# Altium schematic sheet INTERFACE.SchDoc
size Letter; SheetNumber: 3; SheetTotal: 4
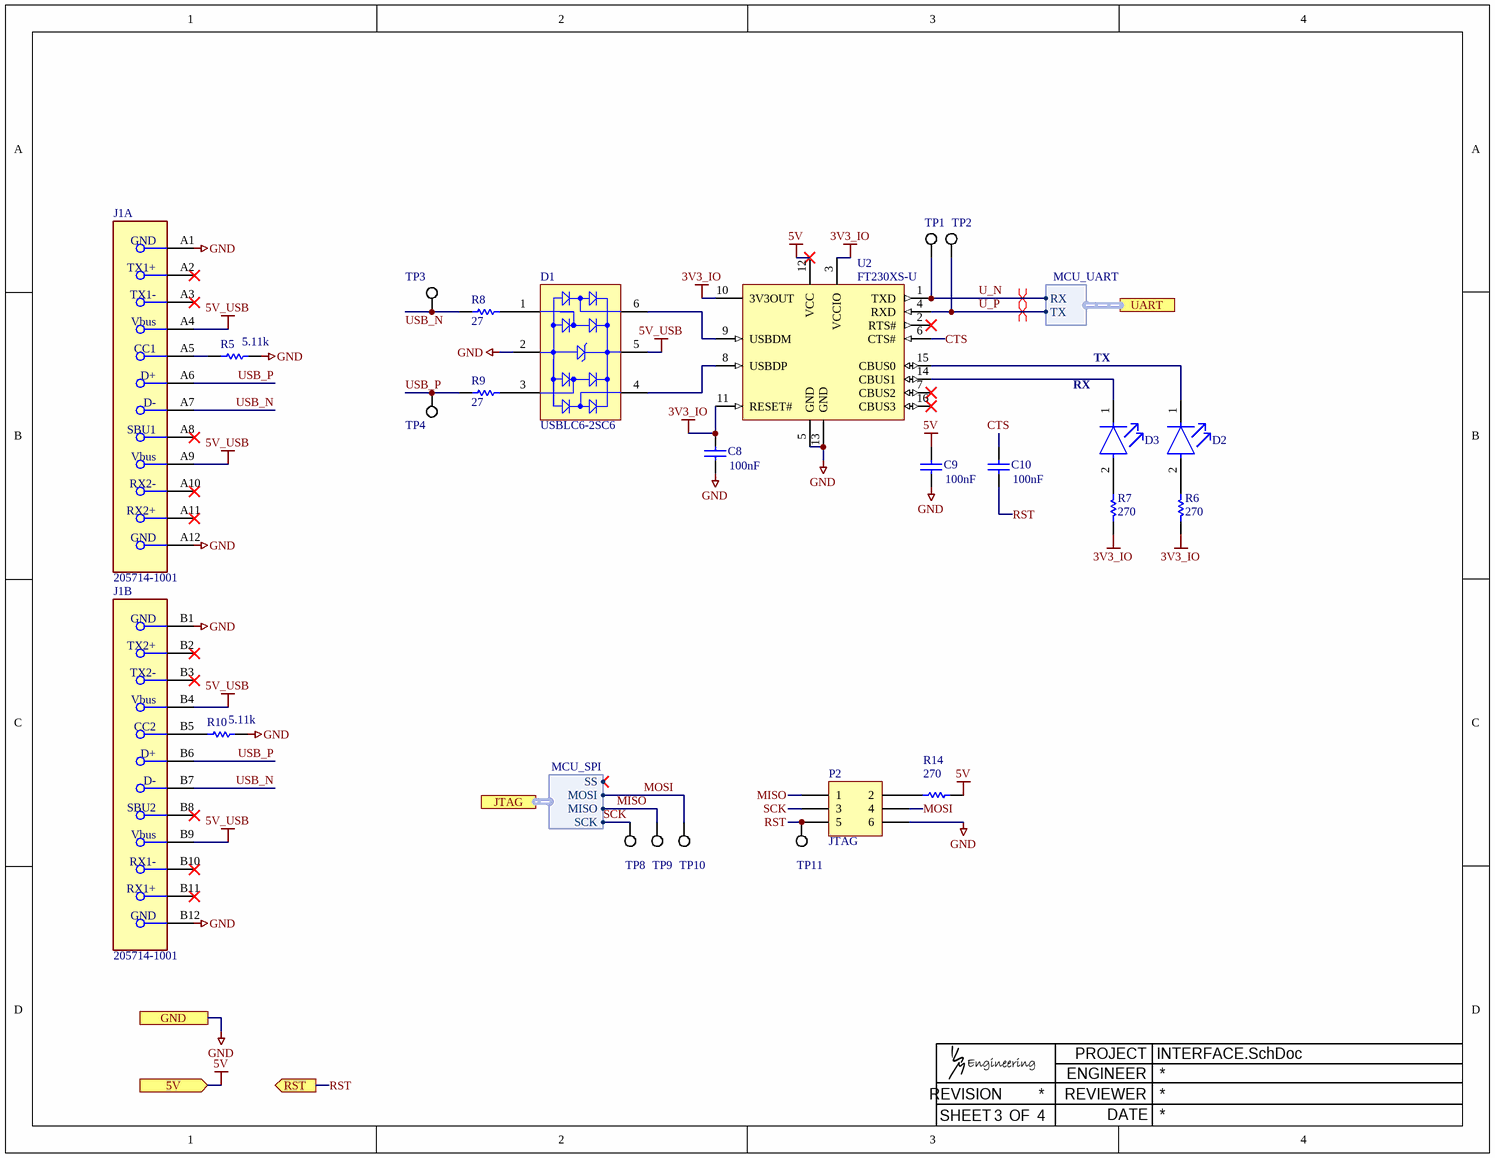
[diagram p0: INTERFACE.SchDoc]

## Parts
C8  100nF  [CAPC1005X56X25ML10T15]
C9  100nF  [CAPC1005X56X25ML10T15]
C10  100nF  [CAPC1005X56X25ML10T15]
D1  USBLC6-2SC6  [STM-SOT23-6L_V]
D2  LTST-C190KGKT  [FP-LTST-C190KGKT-MFG]  (value not drawn)
D3  LTST-C190KGKT  [FP-LTST-C190KGKT-MFG]  (value not drawn)
J1  205714-1001  [FP-205714-1001-MFG]  (parts A,B of 3)
P2  MHDR2X3  [MHDR2X3]  (value not drawn)
R5  5.11k  [RESC1005X40X25NL05T05]
R6  270  [RESC1005X40X25NL05T05]
R7  270  [RESC1005X40X25NL05T05]
R8  27  [RESC1005X40X25LL10T10]
R9  27  [RESC1005X40X25LL10T10]
R10  5.11k  [RESC1005X40X25NL05T05]
R14  270  [RESC1005X40X25NL05T05]
TP1  5019  [KSTN-5019_V]  (value not drawn)
TP2  5019  [KSTN-5019_V]  (value not drawn)
TP3  5019  [KSTN-5019_V]  (value not drawn)
TP4  5019  [KSTN-5019_V]  (value not drawn)
TP8  5019  [KSTN-5019_V]  (value not drawn)
TP9  5019  [KSTN-5019_V]  (value not drawn)
TP10  5019  [KSTN-5019_V]  (value not drawn)
TP11  5019  [KSTN-5019_V]  (value not drawn)
U2  FT230XS-U  [SSOP-16_N]

## Ports
5V (in), GND, JTAG (harness MCU_SPI), RST (out), UART (harness MCU_UART)

## Harnesses
MCU_UART: RX, TX
MCU_SPI: MISO, SCK, MOSI, SS

## Nets
3V3_IO: C8.2 R6.2 R7.2 U2.3(VCCIO) U2.10(3V3OUT) U2.11(RESET#)
5V: C9.2 R14.1 U2.12(VCC) ; port 5V
5V_USB: D1.5(VBUS) J1.A4(Vbus) J1.A9(Vbus) J1.B4(Vbus) J1.B9(Vbus)
GND: C8.1 C9.1 D1.2(GND) J1.A1(GND) J1.A12(GND) J1.B1(GND) J1.B12(GND) P2.6 R5.1 R10.1 U2.5(GND) U2.13(GND) ; port GND
CTS: C10.2 U2.6(CTS#)
MISO: P2.1 TP9.1 ; port JTAG.MISO
MOSI: P2.4 TP10.1 ; port JTAG.MOSI
RST: C10.1 P2.5 TP11.1 ; port RST
SCK: P2.3 TP8.1 ; port JTAG.SCK
U_N: TP1.1 U2.1(TXD) ; port UART.RX
U_P: TP2.1 U2.4(RXD) ; port UART.TX
USB_N: J1.A7(D-) J1.B7(D-) R8.1 TP3.1
USB_P: J1.A6(D+) J1.B6(D+) R9.1 TP4.1
NetD1_1: D1.1(I/O_1) R8.2
NetD1_3: D1.3(I/O_2) R9.2
NetD1_4: D1.4(I/O_3) U2.8(USBDP)
NetD1_6: D1.6(I/O_4) U2.9(USBDM)
NetD2_1: D2.1(C) U2.15(CBUS0)
NetD2_2: D2.2(A) R6.1
NetD3_1: D3.1(C) U2.14(CBUS1)
NetD3_2: D3.2(A) R7.1
NetJ1_A5: J1.A5(CC1) R5.2
NetJ1_B5: J1.B5(CC2) R10.2
NetP2_2: P2.2 R14.2

Not connected (* = marked no-connect by the designer): J1 A2(TX1+)* A3(TX1-)* A8(SBU1)* A10(RX2-)* A11(RX2+)* B2(TX2+)* B3(TX2-)* B8(SBU2)* B10(RX1-)* B11(RX1+)*; U2 2(RTS#)* 7(CBUS2)* 16(CBUS3)*

## Layout directives
differential pair: U_N, U_P

## Notes on the sheet
- TX
- (near D3) RX
- (near P2) JTAG
- SHEET
- REVISION
- OF
- PROJECT
- REVIEWER
- ENGINEER
- DATE

## Library data of the parts
C8-C10 = CMP-1034-02071-2: Manufacturer: AVX Interconnect / Elco; Part Number: 0402YG104ZAT2A
D1 = CMP-2000-05378-1: Very low capacitance ESD protection, 3.5 pF, -40 to 125 degC, 6-Pin SOT23, RoHS, Tape and Reel; Manufacturer: STMicroelectronics; Polarity: Uni-Directional; Clamping Voltage: 17V; Rad Hardened: No; Product Height (mm): 1.3mm; Leakage Current (Max): 0.15uA; Product Length (mm): 3.05mm; Number of Elements: 1; Peak Pulse Current: 5A; Configuration: Dual; Reverse Breakdown Voltage: 6V; Working Voltage (Max): 5V; Capacitance Value: 3.5pF; Suppressor Type: DiodeArrays; Product Depth (mm): 1.75mm; Test Current (It): 1mA; Package / Case: SOT-23; Operating Temperature Max Deg. C: 125C; Package Description: 6-Pin Small Outline Transistor, Body 2.925 x 1.625 mm, Pitch 0.95 mm; Package Reference: SOT23-6L; Datasheet Version: Rev. 5, 10/2011; Operating Temperature Min Deg. C: -40C; Mounting Style: SurfaceMount; Direction Type: Uni-Directional; Mounting: SurfaceMount; Pin Count: 6; Leakage Current: 0.15uA; Packaging: TapeandReel; Operating Temperature Classification: Automotive; Clamping Voltage (Max): 17V; Manufacturer URL: http://www.st.com/; Reverse Stand-off Voltage: 5V; Datasheet URL: http://www.st.com/st-web-ui/static/active/en/resource/technical/document/datasheet/CD00050750.pdf; Working Voltage: 5V; Operating Temp Range: -40Cto125C
D2 D3 = CMP-2000-05197-2: LED GREEN CLEAR CHIP SMD; Test Current: 20mA; Power Rating: 75mW; Forward Voltage: 2V; Wavelength: 574nm; Number of LEDs: 1; Reverse Voltage: 5V; Dominant Wavelength: 571nm; Lens Style: Diffused; Luminous Intensity: 35mcd; Forward Current: 30mA; Viewing Angle: 130°; Lens Color: Colorless; Width: 0.8mm; Case Code (Imperial): 0603; Case Code (Metric): 1608; Number of Pins: 2; Radiation Hardening: No; Package Quantity: 1; Lead Free: Lead Free; Lens Transparency: Clear; Depth: 0.8mm; Power Dissipation: 75mW; Mount: Surface Mount; Max Operating Temperature: 85°C; Case/Package: 0603; Height: 0.8mm; Illumination Color: Green; Color: Green; Length: 1.6mm; Packaging: Tape and Reel; Number of Elements: 1; Min Operating Temperature: -55°C
J1 = CMP-04767-000031-1: USB TYPE C WITH SCREW HOLE  GM
P2 = MHDR2X3: Header, 3-Pin, Dual row; LatestRevisionDate: 17-Jul-2002; LatestRevisionNote: Re-released for DXP Platform.; Publisher: Altium Limited
R5 R10 = CMP-2002-00974-1: Manufacturer: Panasonic; Part Number: ERJ-2RKF5111X
R6 R7 R14 = CMP-1011-00444-2: Part Number: ERJ2RKF2700X; Manufacturer: Panasonic
R8 R9 = CMP-2002-03638-1: Part Number: RK73B1ETTP270J; Manufacturer: KOA Speer
TP1-TP4 TP8-TP11 = CMP-1672-00008-1: Test Point, 1 Position SMD, RoHS, Tape and Reel; ComponentLink1Description: Manufacturer URL; Package Quantity: 1000; DatasheetVersion: 03/2014; Packaging: Tape and Reel; ComponentLink2URL: http://www.keyelco.com/product-pdf.cfm?p=1357; ComponentLink1URL: http://www.keyelco.com/; Mount: Surface Mount; Contact Plating: Silver; PackageDescription: 1-Pin Surface Mount Device, Body 3.81 x 2.03 mm; Pins: 1; RoHSCompliant: True; Mounting Technology: Surface Mount; ComponentLink2Description: Datasheet; PackageReference: 5019
U2 = CMP-0248-00025-2: USB to Basic UART Interface Chip, UHCI/OHCI/EHCI Compatible, USB 2.0 Compatible, -40 to +85 degC, 16-Pin SSOP, Pb-Free, Tube; Manufacturer: FTDI; PackageDescription: 16-Pin Small Outline Package, 8.6 x 3.9 mm Body, 0.635 mm Pitch; ComponentLink2URL: http://www.ftdichip.com/Support/Documents/DataSheets/ICs/DS_FT230X.pdf; ComponentLink3URL: www.ftdichip.com/Products/ICs/FT230X.html; PartNumber: FT230XS-U; RevisionNote: DatasheetVersion updated to 1.2 Feb-2013; PackageVersion: Feb-13; ComponentLink2Description: Datasheet; Code_JEDEC: MO-137-AB; DatasheetVersion: ver 1.2, Feb-2013; ComponentLink1URL: http://www.ftdichip.com/; PackageReference: SSOP-16; ComponentLink1Description: Manufacturer URL; ComponentLink3Description: FT230X Product Page